# Altium schematic sheet Lab7-8_TOP.SchDoc
size B; DrawnBy: Aaron Huinink; SheetNumber: 1; SheetTotal: 5
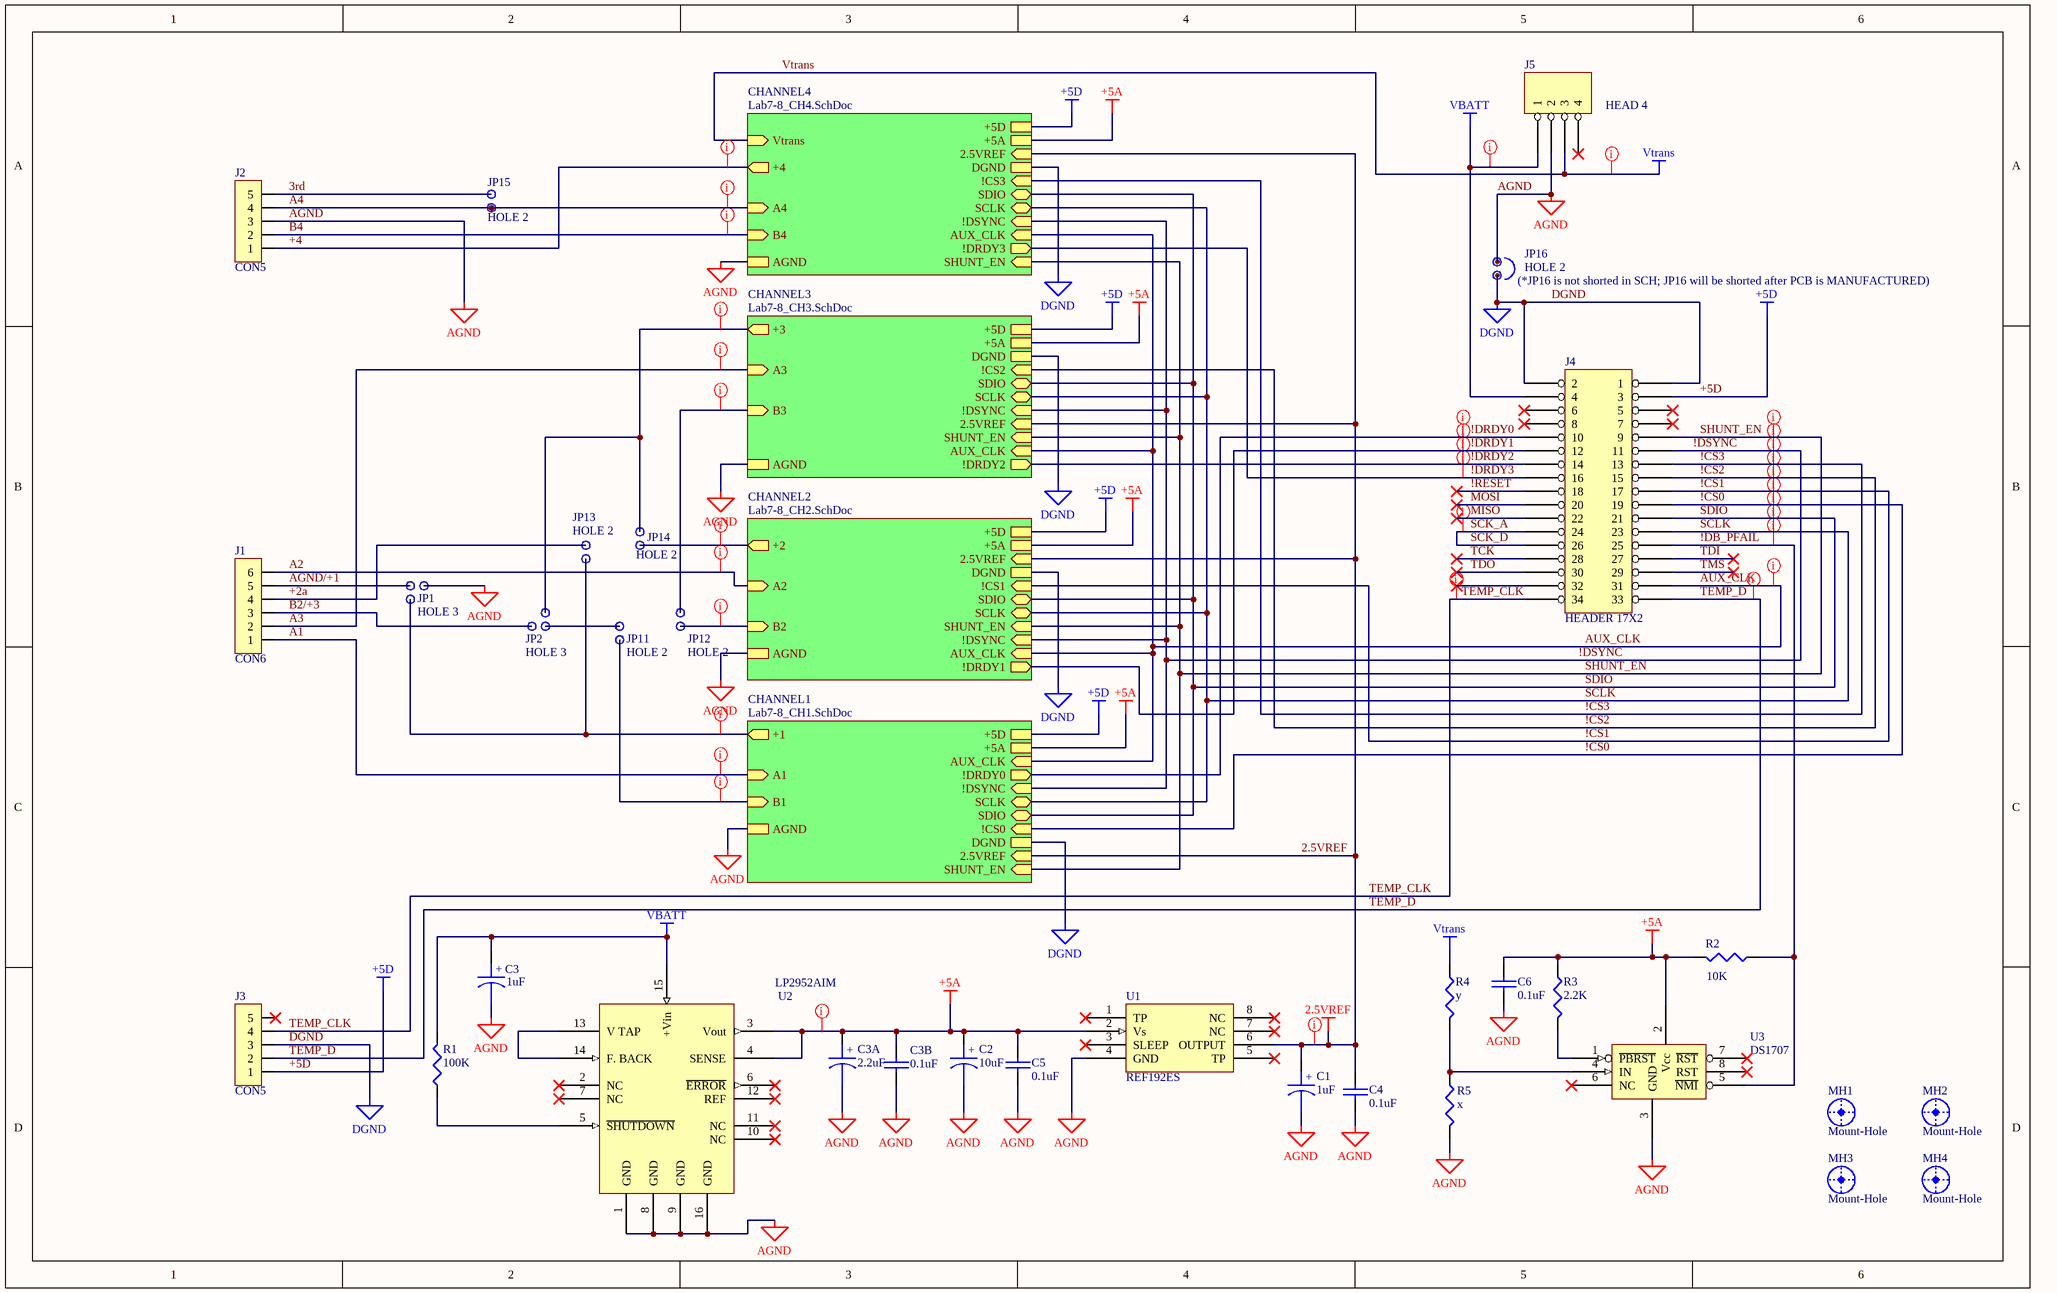
[diagram p0: Lab7-8_TOP.SchDoc]

## Parts
C1  1uF  [3528]
C2  10uF  [3528]
C3  1uF  [3528]
C3A  2.2uF  [3528]
C3B  0.1uF  [0805]
C4  0.1uF  [0805]
C5  0.1uF  [0805]
C6  0.1uF  [0805]
J1  CON6  [FSFD4.6]
J2  CON5  [FSFD4.5]
J3  CON5  [FSFD4.5]
J4  HEADER 17X2  [HDR2X17]
J5  HEAD 4  [70543-4A]
JP1  HOLE 3  [RAD0.1A]
JP2  HOLE 3  [RAD0.1A]
JP11  HOLE 2  [RAD0.1]
JP12  HOLE 2  [RAD0.1]
JP13  HOLE 2  [RAD0.1]
JP14  HOLE 2  [RAD0.1]
JP15  HOLE 2  [RAD0.1]
JP16  HOLE 2  [RAD0.1]
MH1  Mount-Hole  [screw 4-40]
MH2  Mount-Hole  [screw 4-40]
MH3  Mount-Hole  [screw 4-40]
MH4  Mount-Hole  [screw 4-40]
R1  100K  [0805]
R2  10K  [0805]
R3  2.2K  [0805]
R4  y  [0805]
R5  x  [0805]
U1  REF192ES  [SO-8]
U2  LP2952AIM  [SO-16]
U3  DS1707  [SO-8]

## Sub-sheets
CHANNEL1 = Lab7-8_CH1.SchDoc: +1 (out), A1 (in), B1 (in), AGND, AUX_CLK (in), +5A, +5D, !DSYNC (in), SCLK (bidir), SDIO (bidir), !DRDY0 (out), !CS0 (in), DGND, 2.5VREF (in), SHUNT_EN (in)
CHANNEL2 = Lab7-8_CH2.SchDoc: +2 (out), A2 (in), B2 (in), AGND, AUX_CLK (in), +5A, +5D, SCLK (bidir), SDIO (bidir), !DRDY1 (out), !CS1 (in), DGND, 2.5VREF (in), SHUNT_EN (in), !DSYNC (in)
CHANNEL3 = Lab7-8_CH3.SchDoc: AGND, AUX_CLK (in), +5A, +5D, !DSYNC (in), SCLK (bidir), SDIO (bidir), !DRDY2 (out), !CS2 (in), DGND, 2.5VREF (in), SHUNT_EN (in), +3 (out), A3 (in), B3 (in)
CHANNEL4 = Lab7-8_CH4.SchDoc: AGND, AUX_CLK (in), +5A, +5D, !DSYNC (in), SCLK (bidir), SDIO (bidir), !DRDY3 (out), !CS3 (in), DGND, 2.5VREF (in), SHUNT_EN (in), Vtrans (in), +4 (out), A4 (in), B4 (in)

## Nets
2.5VREF: C1.1 C4.1 U1.6(OUTPUT) ; sheet CHANNEL1/2.5VREF, sheet CHANNEL2/2.5VREF, sheet CHANNEL3/2.5VREF, sheet CHANNEL4/2.5VREF
+5A: C2.1 C3A.1 C3B.1 C5.1 C6.1 R2.2 R3.1 U1.2(Vs) U2.3(Vout) U2.4(SENSE) U3.2(Vcc) ; sheet CHANNEL1/+5A, sheet CHANNEL2/+5A, sheet CHANNEL3/+5A, sheet CHANNEL4/+5A
+5D: J3.1 J4.3 ; sheet CHANNEL1/+5D, sheet CHANNEL2/+5D, sheet CHANNEL3/+5D, sheet CHANNEL4/+5D
AGND: C1.2 C2.2 C3.2 C3A.2 C3B.2 C4.2 C5.2 C6.2 J2.3 J5.2 JP1.3 JP16.2 R5.2 U1.4(GND) U2.1(GND) U2.8(GND) U2.9(GND) U2.16(GND) U3.3(GND) ; sheet CHANNEL1/AGND, sheet CHANNEL2/AGND, sheet CHANNEL3/AGND, sheet CHANNEL4/AGND
DGND: J3.3 J4.1 J4.2 JP16.1 ; sheet CHANNEL1/DGND, sheet CHANNEL2/DGND, sheet CHANNEL3/DGND, sheet CHANNEL4/DGND
VBATT: C3.1 J4.4 J5.1 R1.2 U2.15(+Vin)
Vtrans: J5.3 R4.1 ; sheet CHANNEL4/Vtrans
3rd: J2.5 JP15.2
!CS0: J4.19 ; sheet CHANNEL1/!CS0
!CS1: J4.17 ; sheet CHANNEL2/!CS1
!CS2: J4.15 ; sheet CHANNEL3/!CS2
!CS3: J4.13 ; sheet CHANNEL4/!CS3
!DB_PFAIL: J4.25 R2.1 U3.5(~{NMI})
!DRDY0: J4.10 ; sheet CHANNEL1/!DRDY0
!DRDY1: J4.12 ; sheet CHANNEL2/!DRDY1
!DRDY2: J4.14 ; sheet CHANNEL3/!DRDY2
!DRDY3: J4.16 ; sheet CHANNEL4/!DRDY3
!DSYNC: J4.11 ; sheet CHANNEL1/!DSYNC, sheet CHANNEL2/!DSYNC, sheet CHANNEL3/!DSYNC, sheet CHANNEL4/!DSYNC
!RESET: J4.18
+2a: J1.4 JP13.2
+4: J2.1 ; sheet CHANNEL4/+4
A1: J1.1 ; sheet CHANNEL1/A1
A2: J1.6 ; sheet CHANNEL2/A2
A3: J1.2 ; sheet CHANNEL3/A3
A4: J2.4 JP15.1 ; sheet CHANNEL4/A4
AGND/+1: J1.5 JP1.2
AUX_CLK: J4.31 ; sheet CHANNEL1/AUX_CLK, sheet CHANNEL2/AUX_CLK, sheet CHANNEL3/AUX_CLK, sheet CHANNEL4/AUX_CLK
B2/+3: J1.3 JP2.3
B4: J2.2 ; sheet CHANNEL4/B4
MISO: J4.22
MOSI: J4.20
SCK_A: J4.24 J4.26  [also labelled SCK_D]
SCLK: J4.23 ; sheet CHANNEL1/SCLK, sheet CHANNEL2/SCLK, sheet CHANNEL3/SCLK, sheet CHANNEL4/SCLK
SDIO: J4.21 ; sheet CHANNEL1/SDIO, sheet CHANNEL2/SDIO, sheet CHANNEL3/SDIO, sheet CHANNEL4/SDIO
SHUNT_EN: J4.9 ; sheet CHANNEL1/SHUNT_EN, sheet CHANNEL2/SHUNT_EN, sheet CHANNEL3/SHUNT_EN, sheet CHANNEL4/SHUNT_EN
TCK: J4.28
TDI: J4.27
TDO: J4.30
TEMP_CLK: J3.4 J4.34
TEMP_D: J3.2 J4.33
TMS: J4.29
NetJP1_1: JP1.1 JP13.1 ; sheet CHANNEL1/+1
NetJP2_1: JP2.1 JP14.2 ; sheet CHANNEL3/+3
NetJP2_2: JP2.2 JP11.2
NetJP11_1: JP11.1 ; sheet CHANNEL1/B1
NetJP12_1: JP12.1 ; sheet CHANNEL2/B2
NetJP12_2: JP12.2 ; sheet CHANNEL3/B3
NetJP14_1: JP14.1 ; sheet CHANNEL2/+2
NetR1_1: R1.1 U2.5(~{SHUTDOWN})
NetR3_2: R3.2 U3.1(~{PBRST})
NetR4_2: R4.2 R5.1 U3.4(IN)
NetU2_13: U2.13(V_TAP) U2.14(F._BACK)

Not connected (* = marked no-connect by the designer): J3 5*; J4 5* 6* 7* 8* 32*; J5 4*; U1 1(TP)* 3(SLEEP)* 5(TP)* 7(NC)* 8(NC)*; U2 2(NC)* 6(~{ERROR})* 7(NC)* 10(NC)* 11(NC)* 12(REF)*; U3 6(NC)* 7(~{RST})* 8(RST)*

## Layout directives
net class Digital: !CS0, !CS1, !CS2, !CS3, !DB_PFAIL, !DRDY0, !DRDY1, !DRDY2, !DRDY3, !DSYNC, AUX_CLK, SCK_A, SCLK, SDIO, SHUNT_EN, TEMP_CLK, TEMP_D
net class Power: +4, +5A, NetJP1_1, NetJP2_1, NetJP14_1, VBATT, Vtrans
net class 2.5V_REF: 2.5VREF
net class Analog: A1, A2, A3, A4, B4, NetJP11_1, NetJP12_1, NetJP12_2

## Notes on the sheet
- (near JP16) (*JP16 is not shorted in SCH; JP16 will be shorted after PCB is MANUFACTURED)
- Title
- Size:
- Date:
- A
- Number:
- Time:
- Revision:
- Sheet
- of
- File:
- (in symbol CAPACITOR POL) +

## Library data of the parts
C1-C3 C3A = CAPACITOR POL: Part Field 1: TANT
C3B C4-C6 = CAP
J4 = HEADER 2X17
J5 = HEADER 4
MH1-MH4 = MountHole: Mount hole; LatestRevisionDate: 17-Jul-2002; LatestRevisionNote: Re-released for DXP Platform.; Publisher: Altium Limited
R1-R5 = RES1